# Altium schematic sheet LSM6DSOTR1_LSM6DSOTR.schdoc
size 124 x 101 mm
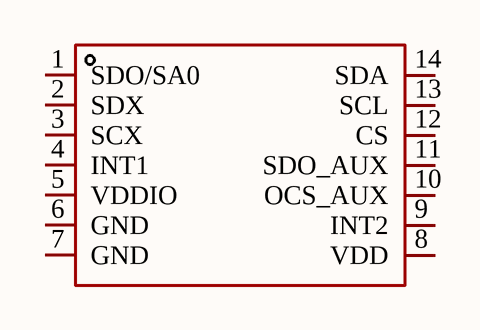
[diagram p0: LSM6DSOTR1_LSM6DSOTR.schdoc]

## Parts
U?  LSM6DSOTR  [LGA-14_L3.0-W2.5-P0.50-TL]  (value not drawn)

## Nets

Not connected (* = marked no-connect by the designer): U? 1(SDO/SA0) 2(SDX) 3(SCX) 4(INT1) 5(VDDIO) 6(GND) 7(GND) 8(VDD) 9(INT2) 10(OCS_AUX) 11(SDO_AUX) 12(CS) 13(SCL) 14(SDA)

## Library data of the parts
U? = LSM6DSOTR: Manufacturer: ST(意法半导体); Add into BOM: yes; Sensor Type: Accelerometer gyroscope; Symbol: LSM6DSOTR; Device: LSM6DSOTR; LCSC Part Name: LSM6DSOTR; Supplier Part: C2655100; Manufacturer Part: LSM6DSOTR; Supplier Footprint: LGA-14(2.5x3); JLCPCB Part Class: Extended Part; Datasheet: https://atta.szlcsc.com/upload/public/pdf/source/20210701/9974CFC31D223BA5E00E2E6AAA61F1A7.pdf; Supplier: LCSC; Convert to PCB: yes; Operating Temperature: -40℃~+85℃